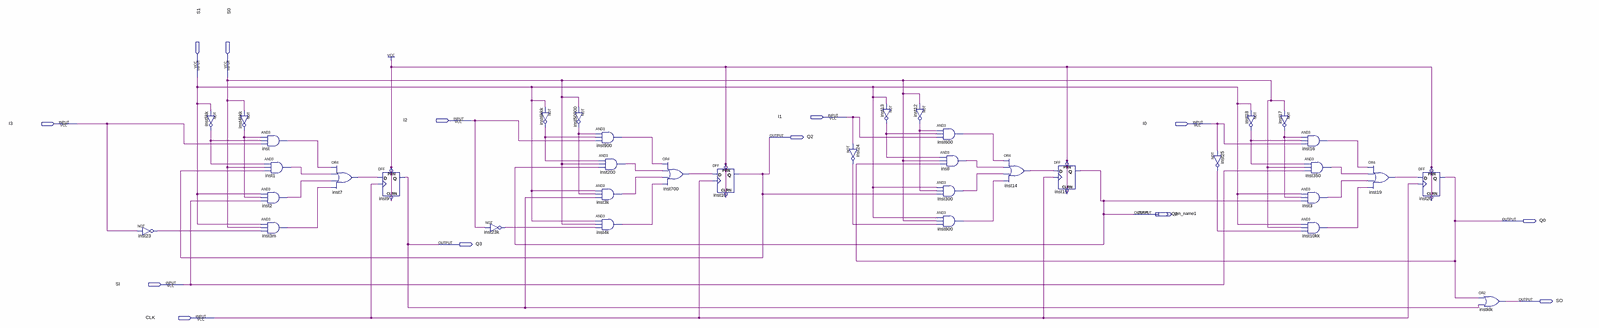
[diagram p0: schematic sheet, whole]
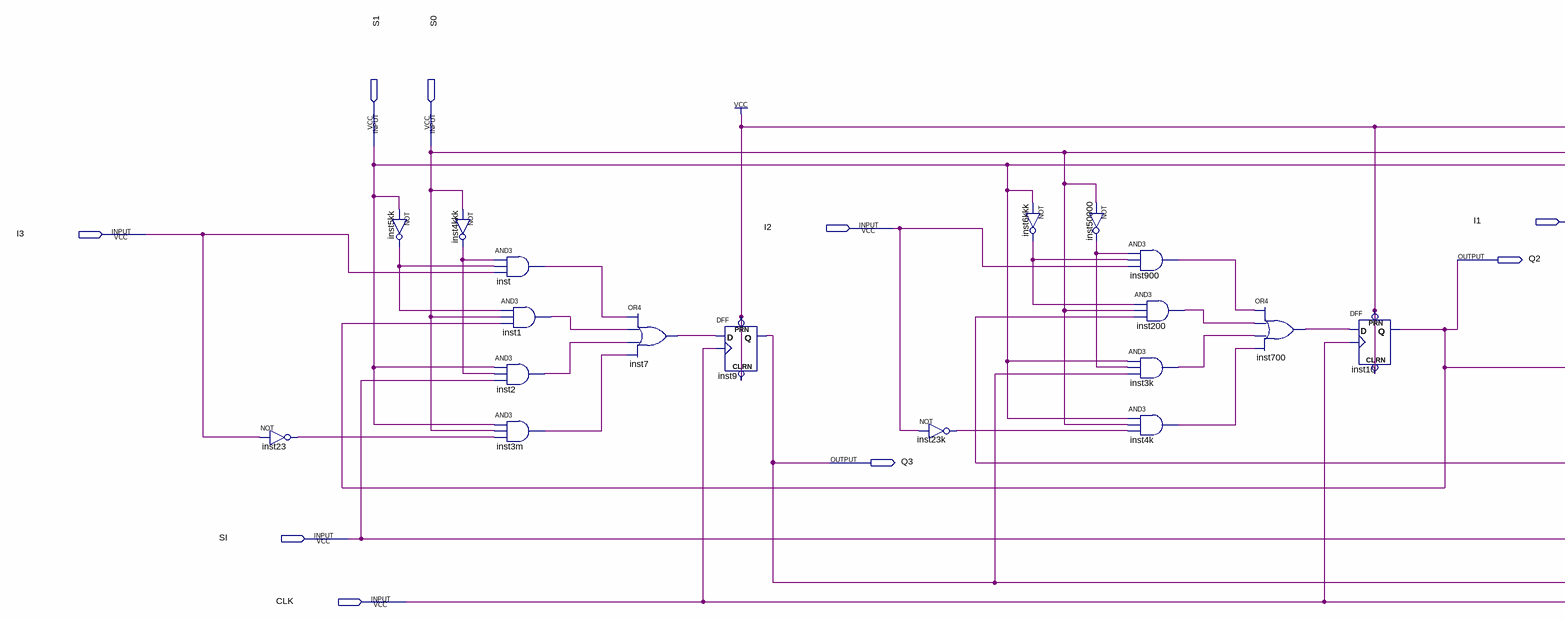
[diagram p1: schematic sheet, left part]
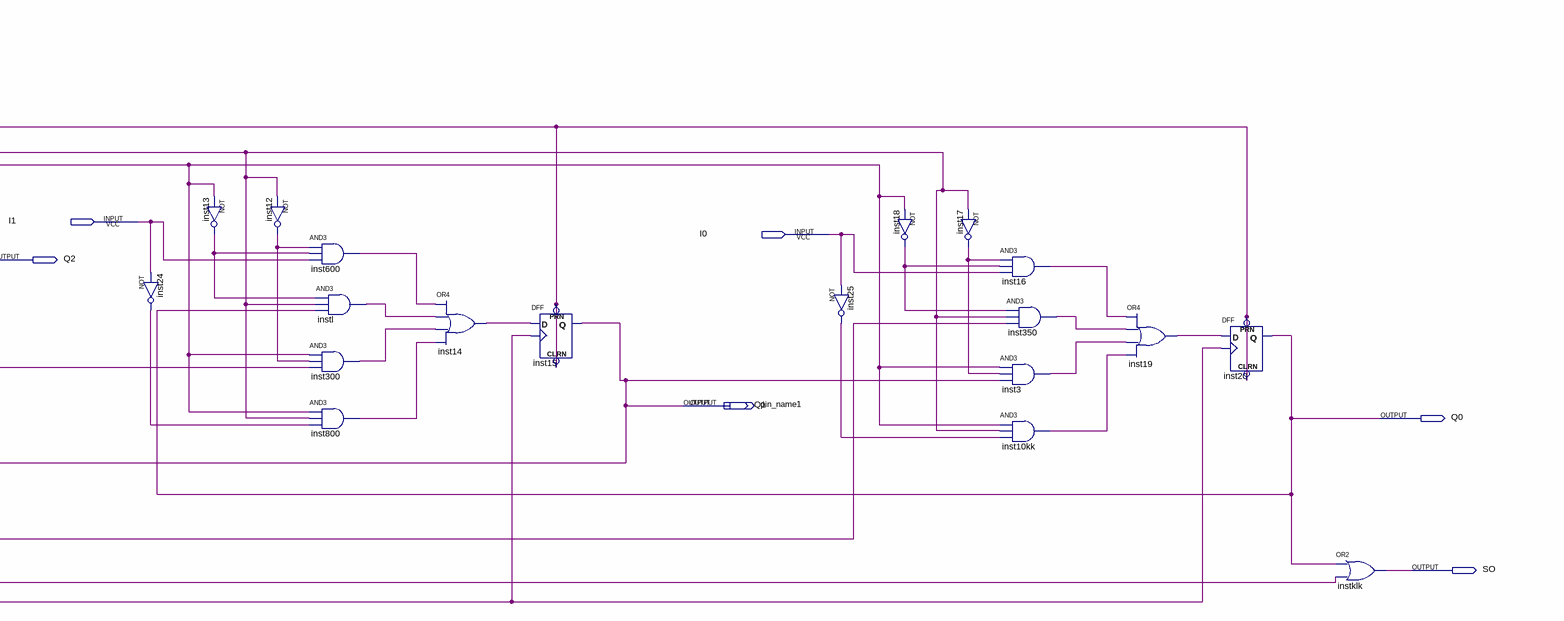
[diagram p2: schematic sheet, right part]
// Quartus schematic REGISTER.bdf as structural Verilog: 37 symbols, 14 pins
module REGISTER (
  input  S1,
  input  S0,
  input  I1,
  input  I2,
  input  I3,
  input  I0,
  input  SI,
  input  CLK,
  output Q2,
  output Q1,
  output pin_name1,
  output Q0,
  output Q3,
  output SO
);

  wire inst1_out, inst2_out, inst3_out, inst3k_out, inst3m_out, inst4k_out, inst4kkk_out, inst5kk_out,
       inst6kkk_out, inst7_out, inst10kk_out, inst12_out, inst13_out, inst14_out, inst16_out, inst17_out,
       inst18_out, inst19_out, inst23_out, inst23k_out, inst24_out, inst25_out, inst200_out, inst300_out,
       inst350_out, inst600_out, inst700_out, inst800_out, inst900_out, inst50000_out, inst_out, instl_out;

  not inst23 (inst23_out, I3);
  not inst5kk (inst5kk_out, S1);
  not inst4kkk (inst4kkk_out, S0);
  and inst (inst_out, inst4kkk_out, inst5kk_out, I3);
  and inst1 (inst1_out, inst5kk_out, S0, Q2);
  and inst2 (inst2_out, S1, inst4kkk_out, SI);
  and inst3m (inst3m_out, S1, S0, inst23_out);
  or inst7 (inst7_out, inst_out, inst1_out, inst2_out, inst3m_out);
  DFF inst9 (.CLRN(1'b1), .CLK(CLK), .D(inst7_out), .PRN(1'b1), .Q(Q3));
  not inst23k (inst23k_out, I2);
  not inst6kkk (inst6kkk_out, S1);
  not inst50000 (inst50000_out, S0);
  and inst900 (inst900_out, inst50000_out, inst6kkk_out, I2);
  and inst200 (inst200_out, inst6kkk_out, S0, Q1);
  and inst3k (inst3k_out, S1, inst50000_out, Q3);
  and inst4k (inst4k_out, S1, S0, inst23k_out);
  or inst700 (inst700_out, inst900_out, inst200_out, inst3k_out, inst4k_out);
  DFF inst10 (.CLRN(1'b1), .CLK(CLK), .D(inst700_out), .PRN(1'b1), .Q(Q2));
  not inst24 (inst24_out, I1);
  not inst13 (inst13_out, S1);
  not inst12 (inst12_out, S0);
  and inst600 (inst600_out, inst12_out, inst13_out, I1);
  and instl (instl_out, inst13_out, S0, Q0);
  and inst300 (inst300_out, S1, inst12_out, Q2);
  and inst800 (inst800_out, S1, S0, inst24_out);
  or inst14 (inst14_out, inst600_out, instl_out, inst300_out, inst800_out);
  DFF inst15 (.CLRN(1'b1), .CLK(CLK), .D(inst14_out), .PRN(1'b1), .Q(Q1));
  not inst25 (inst25_out, I0);
  not inst18 (inst18_out, S1);
  not inst17 (inst17_out, S0);
  and inst16 (inst16_out, inst17_out, inst18_out, I0);
  and inst350 (inst350_out, inst18_out, S0, SI);
  and inst3 (inst3_out, S1, inst17_out, Q1);
  and inst10kk (inst10kk_out, S1, S0, inst25_out);
  or inst19 (inst19_out, inst16_out, inst350_out, inst3_out, inst10kk_out);
  DFF inst20 (.CLRN(1'b1), .CLK(CLK), .D(inst19_out), .PRN(1'b1), .Q(Q0));
  or instklk (SO, Q0, Q3);
endmodule
